# EAGLE design Nintendo 64 (EAGLE 9.6.2)
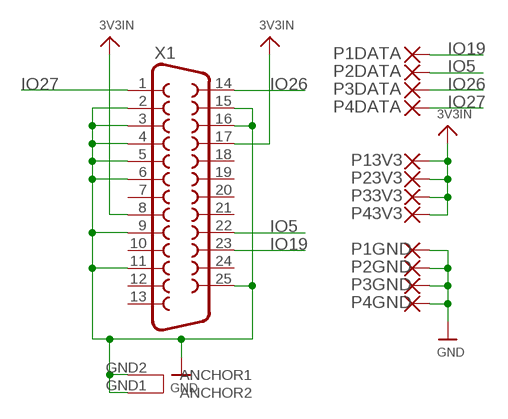
[diagram p0: schematic, sheet 1]

## Parts
P1DATA  SMD5  [SMD2,54-5,08]
P1GND  SMD5  [SMD2,54-5,08]
P2DATA  SMD5  [SMD2,54-5,08]
P2GND  SMD5  [SMD2,54-5,08]
P3DATA  SMD5  [SMD2,54-5,08]
P3GND  SMD5  [SMD2,54-5,08]
P4DATA  SMD5  [SMD2,54-5,08]
P4GND  SMD5  [SMD2,54-5,08]
P13V3  SMD5  [SMD2,54-5,08]
P23V3  SMD5  [SMD2,54-5,08]
P33V3  SMD5  [SMD2,54-5,08]
P43V3  SMD5  [SMD2,54-5,08]
X1  DB25_FEMALEHP  [F25HP]

## Nets
3V3IN: P13V3.1(P) P23V3.1(P) P33V3.1(P) P43V3.1(P) X1.8 X1.17
GND: P1GND.1(P) P2GND.1(P) P3GND.1(P) P4GND.1(P) X1.2 X1.3 X1.4 X1.5 X1.6 X1.9 X1.11 X1.15 X1.16 X1.25 X1.GND1(ANCHOR2) X1.GND2(ANCHOR1)
IO5: P2DATA.1(P) X1.22
IO19: P1DATA.1(P) X1.23
IO26: P3DATA.1(P) X1.14
IO27: P4DATA.1(P) X1.1
Unconnected: X1.7 X1.10 X1.12 X1.13 X1.18 X1.19 X1.20 X1.21 X1.24

## Library data of the parts
P1DATA P1GND P2DATA P2GND P3DATA P3GND P4DATA P4GND P13V3 P23V3 P33V3 P43V3 = wirepad:SMD5: SMD PAD
X1 = SparkFun-Retired:DB25_FEMALE: 25 Pin male connector. PCB edge mount for regular PCB thicknesses. This connector will connect directly to the back of a PC parallel port or through a normal DB25 extension cable (M/F). SKU: PRT-08287

## Board
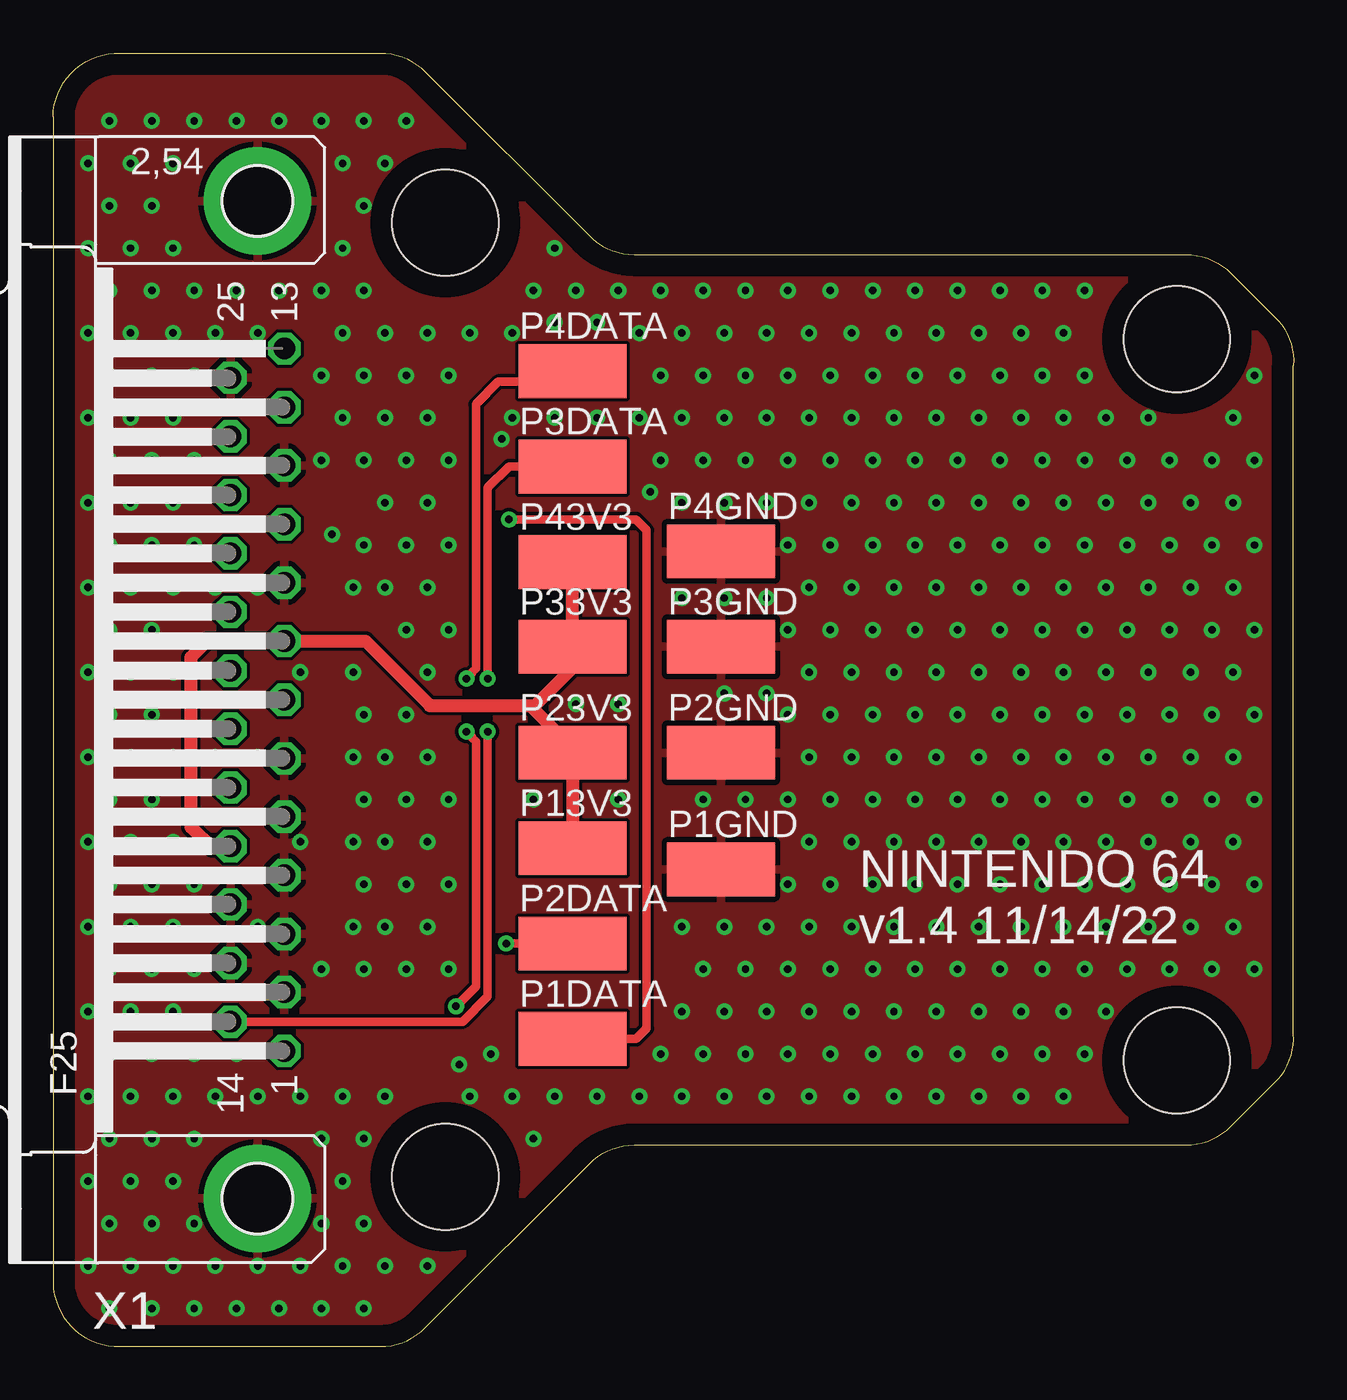
[diagram p1: board, top side]
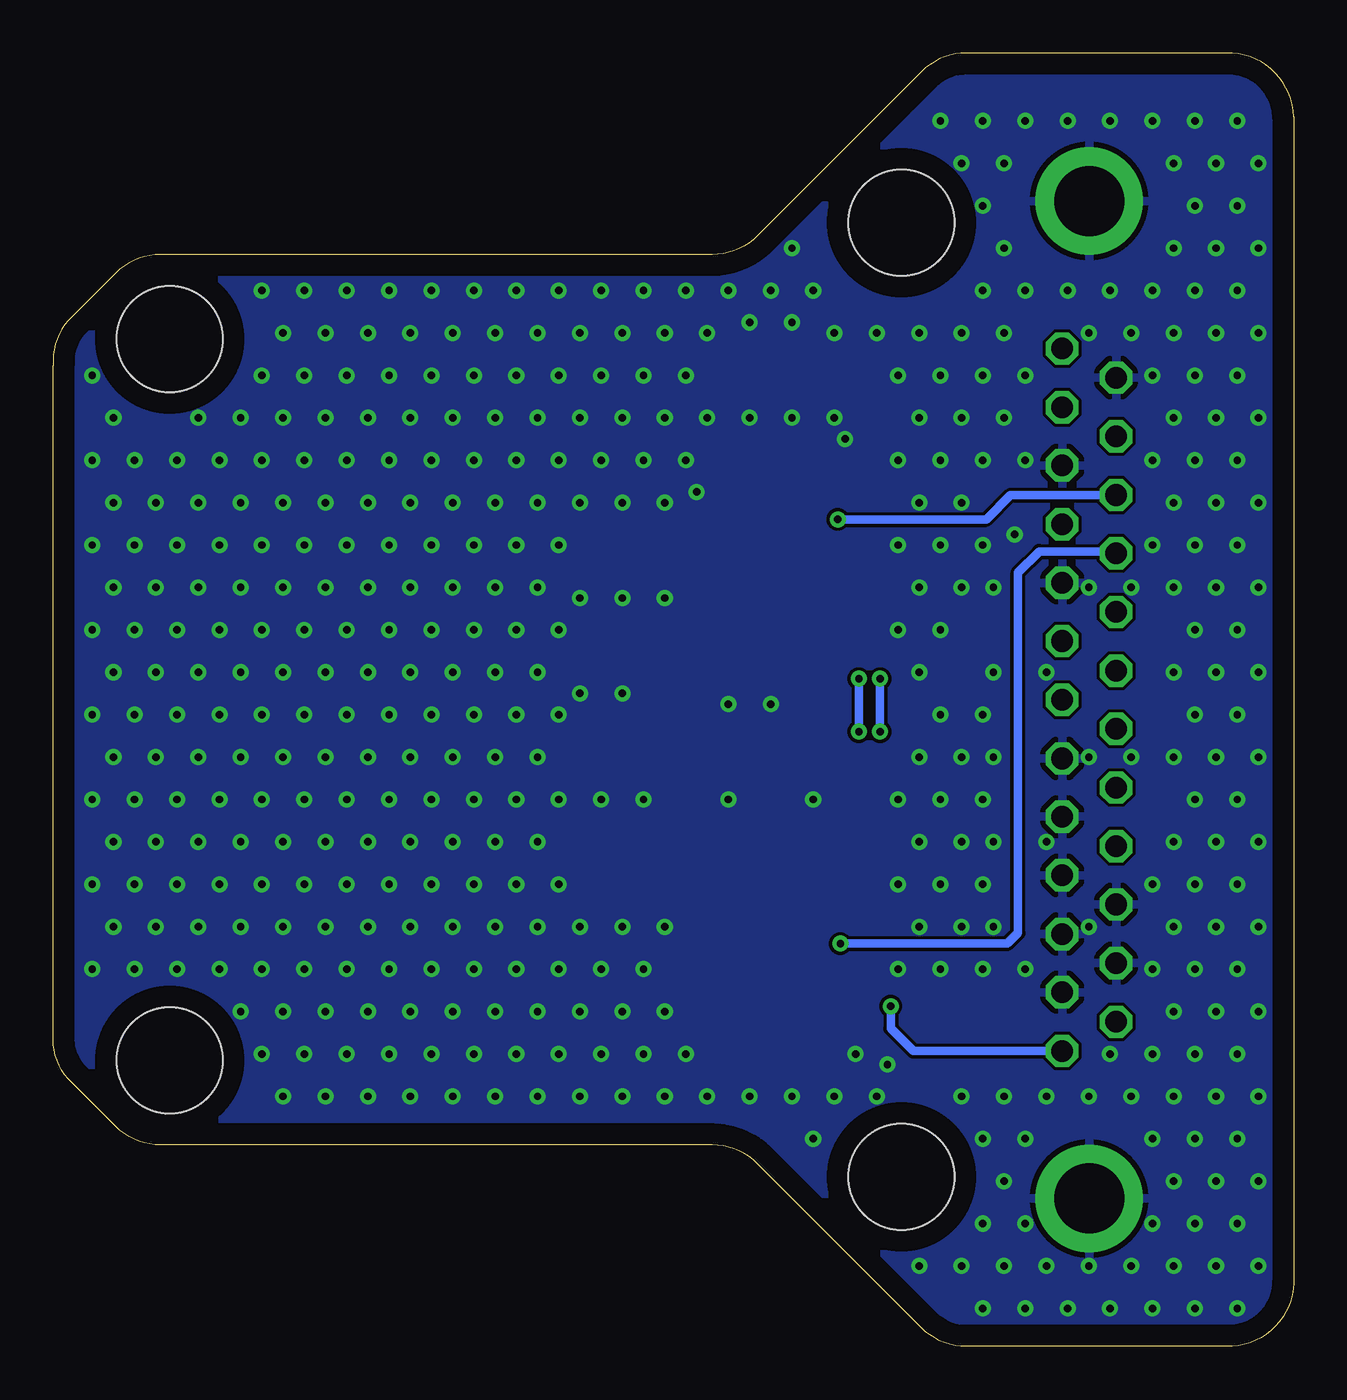
[diagram p2: board, bottom side, seen from below]

Size 58.51 x 61 mm. Coordinates in mm from the lower left corner, seen from the top.
Outline: 0,58 0,3 arc90 3.17,0 15.43,0 arc45 17.55,0.88 25.29,8.62 arc-45 27.41,9.5 53.43,9.5 arc45 55.55,10.38 57.79,12.62 arc45 58.5,14.74 58.5,46.26 arc45 57.79,48.38 55.55,50.62 arc45 53.43,51.5 27.41,51.5 arc-45 25.29,52.38 17.55,60.12 arc45 15.43,61 3.17,61 arc90 0,58
Copper layers (1*16): Top 0.035mm / dielectric 1.5mm / Bottom 0.035mm
Design rules "default": minimum track width 6mil, minimum drill 0.35mm, track to track 6mil, track to pad 6mil, pad to pad 6mil, via to via 6mil, smd to smd 6mil, copper to edge 40mil, drill to drill 6mil, minimum pad ring 10mil, minimum via ring 8mil, stop-mask expansion 4mil, vias tented up to drill 0.5mm, thermal gap 10mil
Holes 5 mm at 53,13.5 53,47.5 18.5,53 18.5,8

### Footprints (pad centres in the part's own frame; a part is rotated, then mirrored left to right if it is on the bottom)
SMD2,54-5,08 = smd 2.54 x 5.08: 1 0,0
F25HP = drill 1.016 octagon: 1 -16.561,-1.27; 2 -13.792,-1.27; 3 -11.049,-1.27; 4 -8.28,-1.27; 5 -5.512,-1.27; 6 -2.769,-1.27; 7 0,-1.27; 8 2.769,-1.27; 9 5.512,-1.27; 10 8.28,-1.27; 11 11.049,-1.27; 12 13.792,-1.27; 13 16.561,-1.27; 14 -15.189,1.27; 15 -12.421,1.27; 16 -9.652,1.27; 17 -6.909,1.27; 18 -4.14,1.27; 19 -1.372,1.27; 20 1.372,1.27; 21 4.14,1.27; 22 6.909,1.27; 23 9.652,1.27; 24 12.421,1.27; 25 15.189,1.27 | drill 3.302 pad 5.08: GND1 -23.52,0; GND2 23.52,0

### Placement (x,y rotation side)
P1DATA  24.5,14.5 270 top
P1GND  31.5,22.5 270 top
P2DATA  24.5,19 270 top
P2GND  31.5,28 270 top
P3DATA  24.5,41.5 270 top
P3GND  31.5,33 270 top
P4DATA  24.5,46 270 top
P4GND  31.5,37.5 270 top
P13V3  24.5,23.5 270 top
P23V3  24.5,28 270 top
P33V3  24.5,33 270 top
P43V3  24.5,37 270 top
X1  9.64,30.5 90 top

### Tracks (layer width: path | path; a pad name or v marks a point on that pad's centre or on a via)
3V3IN
  Top 0.61: 22.5,30.23 17.77,30.23 14.73,33.27 X1.8 7.27,33.27 6.5,32.5 6.5,24.5 7.5,23.5 8.28,23.5 X1.17 | 22.5,30.23 22.73,30.23 24.5,31.99 P33V3.1 P43V3.1 | 22.5,30.23 24.5,28.23 P23V3.1 P13V3.1
GND  (via drill 0.35)
  other vias: 2.66,1.8 1.66,3.8 2.66,5.8 1.66,7.8 2.66,9.8 1.66,11.8 2.66,13.8 1.66,15.8 2.66,17.8 1.66,19.8 2.66,21.8 1.66,23.8 2.66,25.8 1.66,27.8 2.66,29.8 1.66,31.8 2.66,33.8 1.66,35.8 2.66,37.8 1.66,39.8 2.66,41.8 1.66,43.8 2.66,45.8 1.66,47.8 2.66,49.8 1.66,51.8 2.66,53.8 1.66,55.8 2.66,57.8 4.66,1.8 3.66,3.8 4.66,5.8 3.66,7.8 4.66,9.8 3.66,11.8 4.66,13.8 3.66,15.8 4.66,17.8 3.66,19.8 4.66,21.8 3.66,23.8 4.66,25.8 3.66,27.8 4.66,29.8 3.66,31.8 4.66,33.8 3.66,35.8 4.66,37.8 3.66,39.8 4.66,41.8 3.66,43.8 4.66,45.8 3.66,47.8 4.66,49.8 3.66,51.8 4.66,53.8 3.66,55.8 4.66,57.8 6.66,1.8 5.66,3.8 6.66,5.8 5.66,7.8 6.66,9.8 5.66,11.8 6.66,13.8 5.66,15.8 6.66,17.8 5.66,19.8 6.66,21.8 5.66,23.8 5.66,27.8 5.66,31.8 5.66,35.8 6.66,37.8 5.66,39.8 6.66,41.8 5.66,43.8 6.66,45.8 5.66,47.8 6.66,49.8 5.66,51.8 5.66,55.8 6.66,57.8 8.66,1.8 7.66,3.8 7.66,11.8 8.66,13.8 7.66,27.8 7.66,35.8 7.66,47.8 8.66,49.8 8.66,57.8 10.66,1.8 9.66,3.8 9.66,11.8 9.66,19.8 9.66,27.8 9.66,35.8 9.66,47.8 10.66,49.8 10.66,57.8 12.66,1.8 11.66,3.8 12.66,5.8 12.66,9.8 11.66,11.8 12.66,17.8 11.66,23.8 11.66,31.8 13.16,38.3 12.66,41.8 12.66,45.8 12.66,49.8 12.66,57.8 14.66,1.8 13.66,3.8 14.66,5.8 13.66,7.8 14.66,9.8 13.66,11.8 14.66,17.8 14.16,19.8 14.66,21.8 14.16,23.8 14.66,25.8 14.16,27.8 14.66,29.8 14.16,31.8 14.16,35.8 14.66,37.8 14.66,41.8 13.66,43.8 14.66,45.8 13.66,47.8 14.66,49.8 13.66,51.8 14.66,53.8 13.66,55.8 14.66,57.8 15.66,3.8 15.66,11.8 16.66,17.8 15.66,19.8 16.66,21.8 15.66,23.8 16.66,25.8 15.66,27.8 16.66,29.8 16.66,33.8 15.66,35.8 16.66,37.8 15.66,39.8 16.66,41.8 15.66,43.8 16.66,45.8 15.66,47.8 15.66,55.8 16.66,57.8 17.66,3.8 19.16,13.3 18.66,17.8 17.66,19.8 18.66,21.8 17.66,23.8 18.66,25.8 17.66,27.8 17.66,31.8 18.66,33.8 17.66,35.8 18.66,37.8 17.66,39.8 18.66,41.8 17.66,43.8 18.66,45.8 17.66,47.8 19.66,11.8 20.66,13.8 21.16,42.8 19.66,47.8 22.66,9.8 21.66,11.8 22.66,25.8 21.66,43.8 21.66,47.8 22.66,49.8 23.66,11.8 24.66,30.3 23.66,43.8 23.66,48.3 24.66,49.8 23.66,51.8 25.66,11.8 26.66,25.8 26.66,30.3 25.66,43.8 25.66,48.3 26.66,49.8 27.66,11.8 28.66,13.8 28.16,40.3 28.66,41.8 27.66,43.8 28.66,45.8 27.66,47.8 28.66,49.8 29.66,11.8 30.66,13.8 29.66,15.8 30.66,17.8 29.66,19.8 30.66,25.8 29.66,35.3 29.66,39.8 30.66,41.8 29.66,43.8 30.66,45.8 29.66,47.8 30.66,49.8 31.66,11.8 32.66,13.8 31.66,15.8 32.66,17.8 31.66,19.8 32.66,25.8 33.66,30.8 31.66,30.8 31.66,35.3 31.66,39.8 32.66,41.8 31.66,43.8 32.66,45.8 31.66,47.8 32.66,49.8 33.66,11.8 34.66,13.8 33.66,15.8 34.66,17.8 33.66,19.8 34.66,21.8 34.66,25.8 34.66,29.8 34.66,33.8 33.66,35.3 34.66,37.8 33.66,39.8 34.66,41.8 33.66,43.8 34.66,45.8 33.66,47.8 34.66,49.8 35.66,11.8 36.66,13.8 35.66,15.8 36.66,17.8 35.66,19.8 36.66,21.8 35.66,23.8 36.66,25.8 35.66,27.8 36.66,29.8 35.66,31.8 36.66,33.8 35.66,35.8 36.66,37.8 35.66,39.8 36.66,41.8 35.66,43.8 36.66,45.8 35.66,47.8 36.66,49.8 37.66,11.8 38.66,13.8 37.66,15.8 38.66,17.8 37.66,19.8 38.66,21.8 37.66,23.8 38.66,25.8 37.66,27.8 38.66,29.8 37.66,31.8 38.66,33.8 37.66,35.8 38.66,37.8 37.66,39.8 38.66,41.8 37.66,43.8 38.66,45.8 37.66,47.8 38.66,49.8 39.66,11.8 40.66,13.8 39.66,15.8 40.66,17.8 39.66,19.8 40.66,21.8 39.66,23.8 40.66,25.8 39.66,27.8 40.66,29.8 39.66,31.8 40.66,33.8 39.66,35.8 40.66,37.8 39.66,39.8 40.66,41.8 39.66,43.8 40.66,45.8 39.66,47.8 40.66,49.8 41.66,11.8 42.66,13.8 41.66,15.8 42.66,17.8 41.66,19.8 42.66,21.8 41.66,23.8 42.66,25.8 41.66,27.8 42.66,29.8 41.66,31.8 42.66,33.8 41.66,35.8 42.66,37.8 41.66,39.8 42.66,41.8 41.66,43.8 42.66,45.8 41.66,47.8 42.66,49.8 43.66,11.8 44.66,13.8 43.66,15.8 44.66,17.8 43.66,19.8 44.66,21.8 43.66,23.8 44.66,25.8 43.66,27.8 44.66,29.8 43.66,31.8 44.66,33.8 43.66,35.8 44.66,37.8 43.66,39.8 44.66,41.8 43.66,43.8 44.66,45.8 43.66,47.8 44.66,49.8 45.66,11.8 46.66,13.8 45.66,15.8 46.66,17.8 45.66,19.8 46.66,21.8 45.66,23.8 46.66,25.8 45.66,27.8 46.66,29.8 45.66,31.8 46.66,33.8 45.66,35.8 46.66,37.8 45.66,39.8 46.66,41.8 45.66,43.8 46.66,45.8 45.66,47.8 46.66,49.8 47.66,11.8 48.66,13.8 47.66,15.8 48.66,17.8 47.66,19.8 48.66,21.8 47.66,23.8 48.66,25.8 47.66,27.8 48.66,29.8 47.66,31.8 48.66,33.8 47.66,35.8 48.66,37.8 47.66,39.8 48.66,41.8 47.66,43.8 48.66,45.8 47.66,47.8 48.66,49.8 49.66,15.8 50.66,17.8 49.66,19.8 50.66,21.8 49.66,23.8 50.66,25.8 49.66,27.8 50.66,29.8 49.66,31.8 50.66,33.8 49.66,35.8 50.66,37.8 49.66,39.8 50.66,41.8 49.66,43.8 52.66,17.8 51.66,19.8 52.66,21.8 51.66,23.8 52.66,25.8 51.66,27.8 52.66,29.8 51.66,31.8 52.66,33.8 51.66,35.8 52.66,37.8 51.66,39.8 52.66,41.8 51.66,43.8 54.66,17.8 53.66,19.8 54.66,21.8 53.66,23.8 54.66,25.8 53.66,27.8 54.66,29.8 53.66,31.8 54.66,33.8 53.66,35.8 54.66,37.8 53.66,39.8 54.66,41.8 56.66,17.8 55.66,19.8 56.66,21.8 55.66,23.8 56.66,25.8 55.66,27.8 56.66,29.8 55.66,31.8 56.66,33.8 55.66,35.8 56.66,37.8 55.66,39.8 56.66,41.8 55.66,43.8 56.66,45.8
  pour Top: 0,0 0,61 28.67,61 28.67,51.5 59.17,51.5 59.17,9.5 28.17,9.5 28.17,0
  pour Bottom: 0,0 0,61 28.67,61 28.67,51.5 59.17,51.5 59.17,9.5 28.17,9.5 28.17,0
IO5  (via drill 0.35)
  Top 0.406: P2DATA.1 v21.37,19
  Bottom 0.406: X1.22 8.46,37.5 12,37.5 13,36.5 13,19.5 13.5,19 v21.37,19
IO19  (via drill 0.35)
  Top 0.406: P1DATA.1 27.5,14.5 28,15 28,38.5 27.5,39 v21.5,39
  Bottom 0.406: v21.5,39 14.5,39 13.35,40.15 X1.23
IO26  (via drill 0.35)
  Top 0.406: P3DATA.1 21.5,41.5 20.5,40.5 v20.5,31.5 | v20.5,29 20.5,16.5 19.31,15.31 X1.14
  Bottom 0.406: v20.5,31.5 v20.5,29
IO27  (via drill 0.35)
  Top 0.406: P4DATA.1 24,45.5 21,45.5 19.94,44.44 19.94,31.98 19.77,31.8 19.77,31.77 v19.5,31.5 | v19.5,29 19.77,28.73 19.77,28.7 19.94,28.52 19.94,16.99 v19,16.05
  Bottom 0.406: v19.5,31.5 v19.5,29 | v19,16.05 19,15 17.94,13.94 X1.1

### Text on the board
tPlace: NINTENDO 64 / v1.4 11/14/22